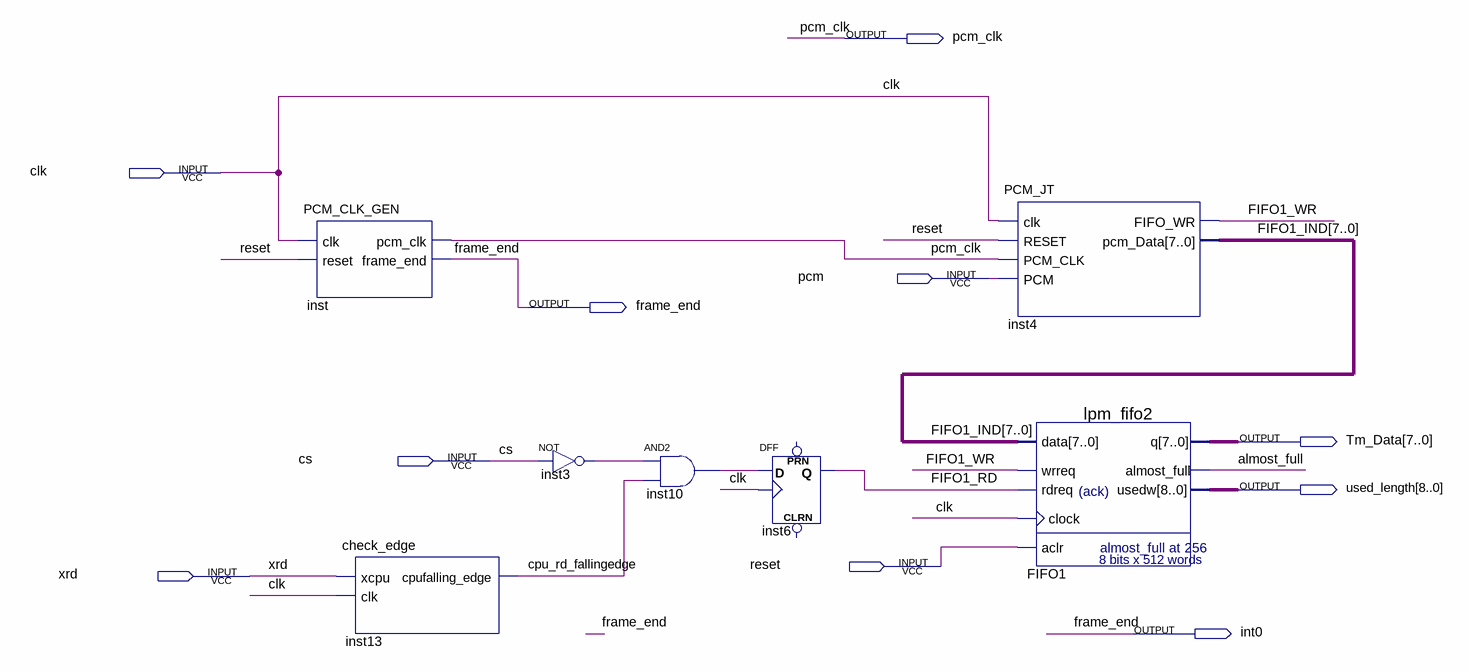
[diagram p0: schematic sheet]
// Quartus schematic TmData.bdf as structural Verilog: 7 symbols, 10 pins
module TmData (
  input  clk,
  input  pcm,
  input  cs,
  input  reset,
  input  xrd,
  output pcm_clk,
  output frame_end,
  output [7:0] Tm_Data,
  output [8:0] used_length,
  output int0
);

  wire almost_full, cpu_rd_fallingedge, FIFO1_RD, FIFO1_WR, inst3_out, inst10_out;
  wire [7:0] FIFO1_IND;

  PCM_CLK_GEN inst (.clk(clk), .reset(reset), .pcm_clk(pcm_clk), .frame_end(frame_end));
  check_edge inst13 (.xcpu(xrd), .clk(clk), .cpufalling_edge(cpu_rd_fallingedge));
  not inst3 (inst3_out, cs);
  and inst10 (inst10_out, inst3_out, cpu_rd_fallingedge);
  DFF inst6 (.CLK(clk), .D(inst10_out), .Q(FIFO1_RD));  // open: CLRN, PRN
  PCM_JT inst4 (.clk(clk), .RESET(reset), .PCM_CLK(pcm_clk), .PCM(pcm), .FIFO_WR(FIFO1_WR), .pcm_Data(FIFO1_IND));
  lpm_fifo2 FIFO1 (
    .data(FIFO1_IND), .wrreq(FIFO1_WR), .rdreq(FIFO1_RD), .clock(clk), .aclr(reset), .q(Tm_Data),
    .almost_full(almost_full), .usedw(used_length));

  assign int0 = frame_end;
endmodule
